# Altium schematic sheet CONNECTOR_A.SchDoc: =project_title
size Tabloid; CompanyName: Luxonis Holding; Organization: Luxonis Holding; Address1: 1925 Harmony Park Drive; Address2: Westminster, CO; Address3: 80234; Address4: United States; SheetNumber: 5; SheetTotal: 15
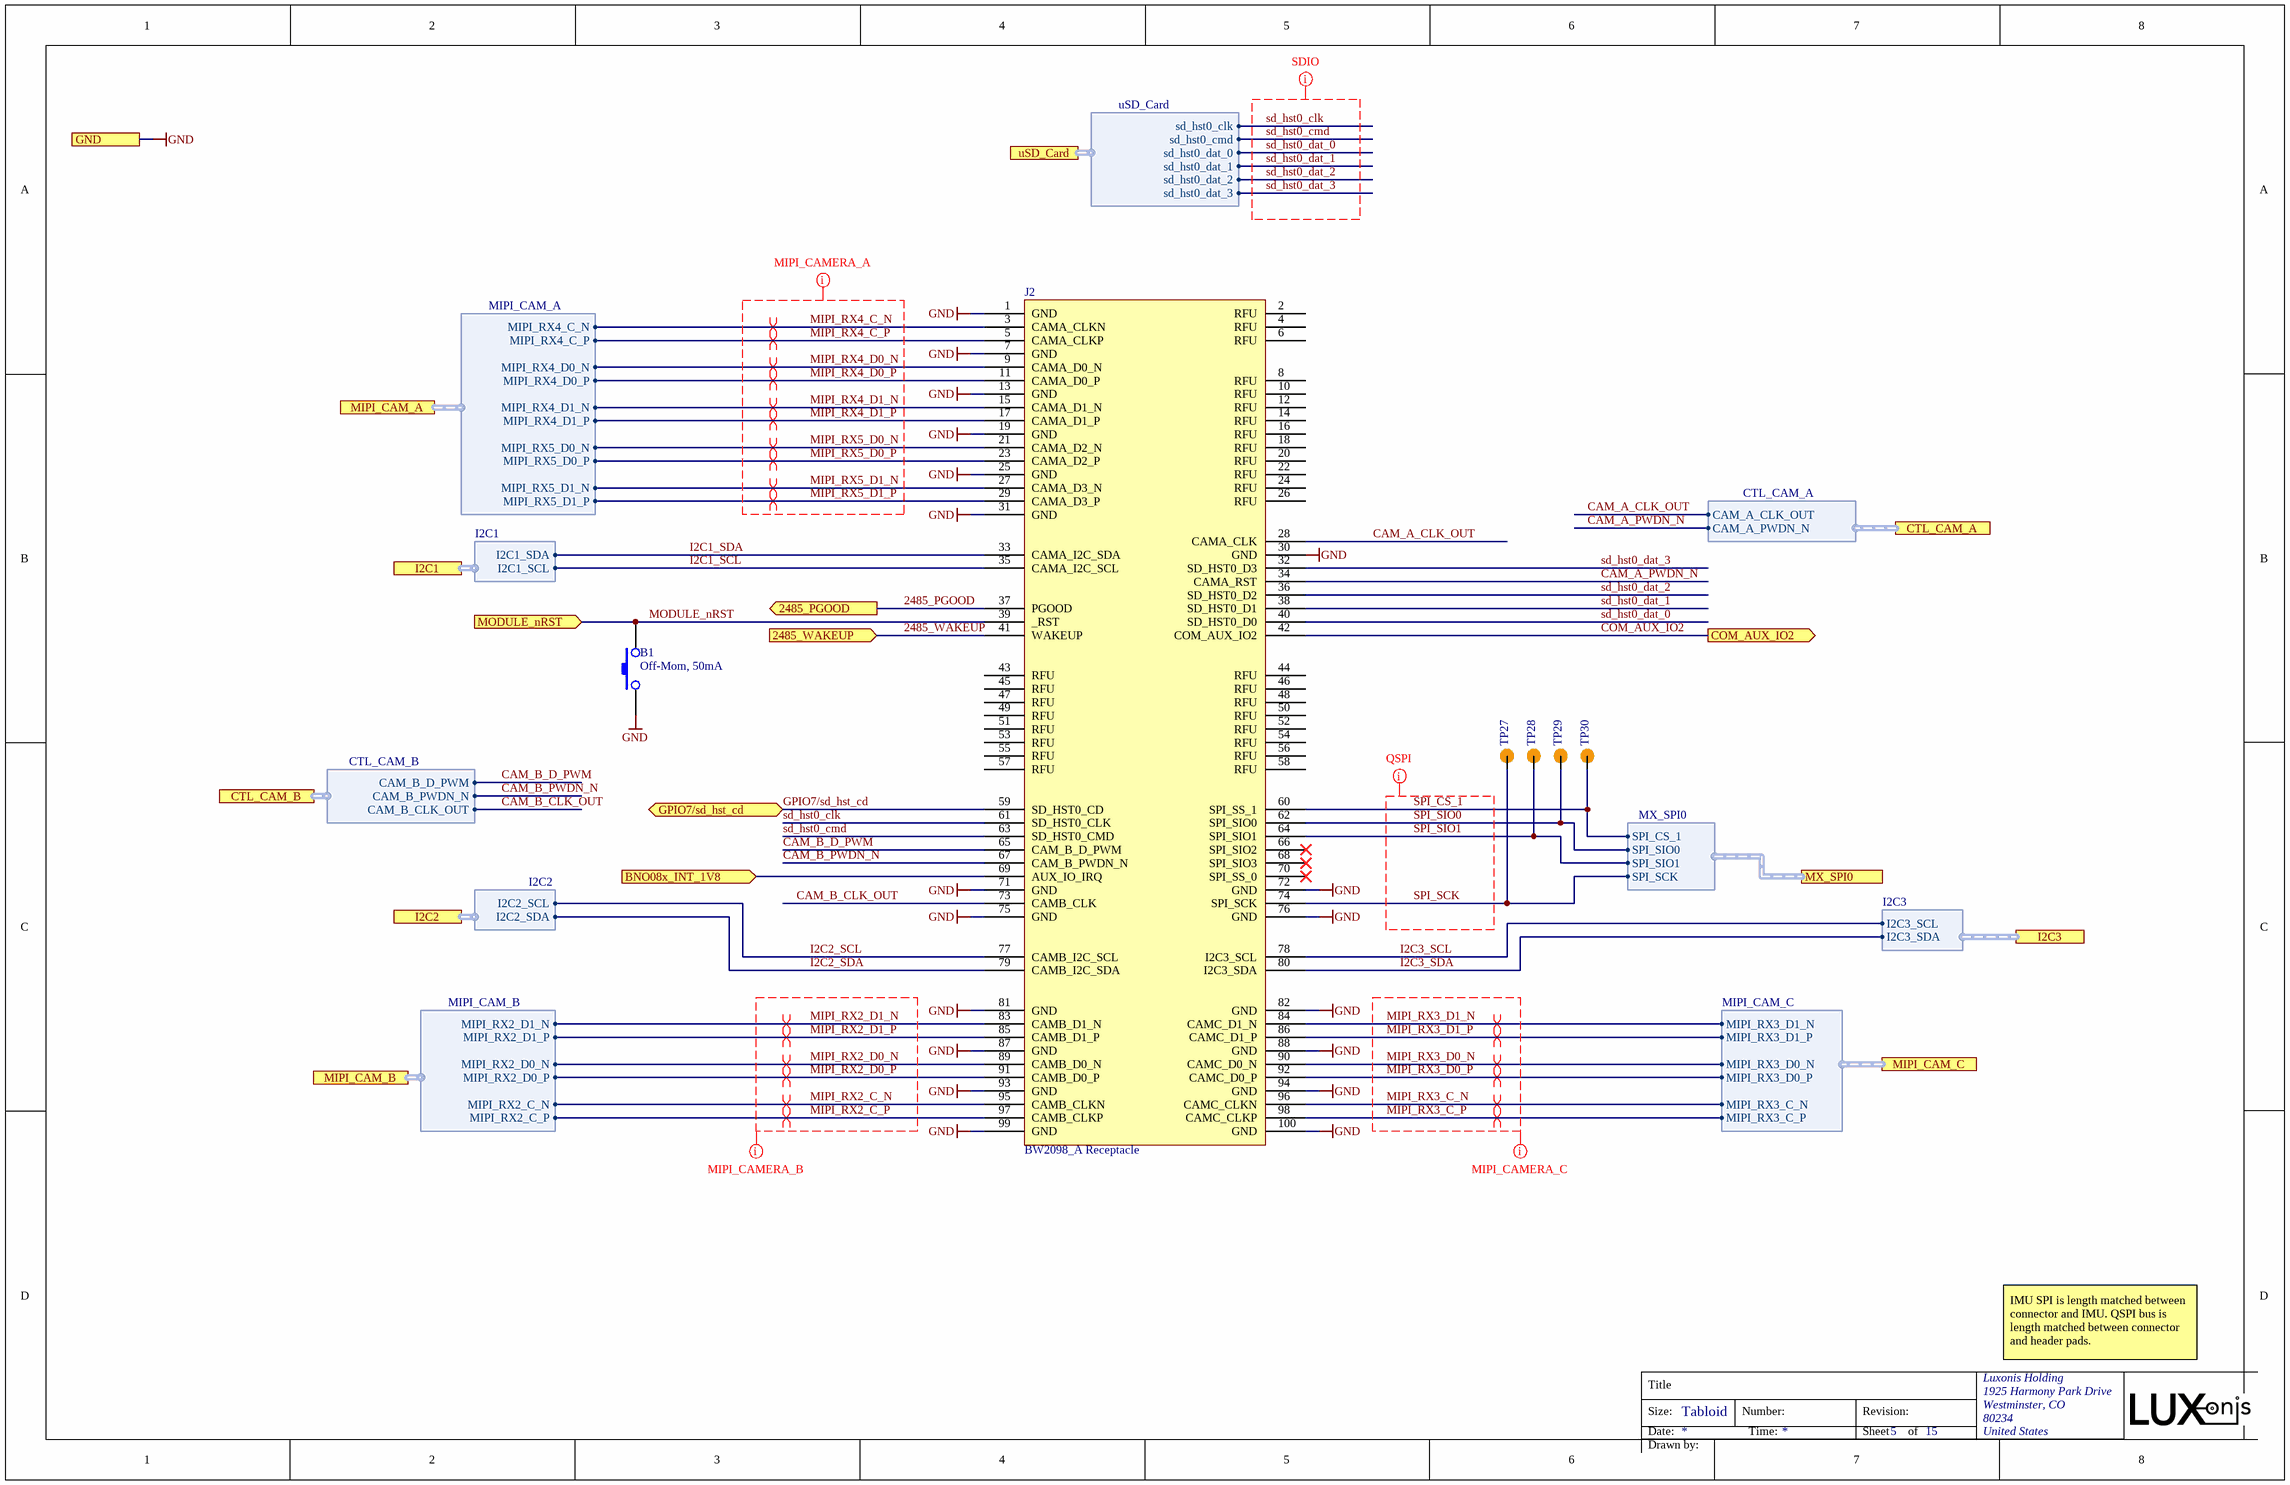
[diagram p0: CONNECTOR_A.SchDoc]

## Parts
B1  Off-Mom, 50mA  [DTSM-32N-V]
J2  BW2098_A Receptacle  [DF40HC-3.0-100DS-0.4V_minpad]
TP27  TP100_200_NS  [TP100_200_NS]  (value not drawn)  (no BOM)
TP28  TP100_200_NS  [TP100_200_NS]  (value not drawn)  (no BOM)
TP29  TP100_200_NS  [TP100_200_NS]  (value not drawn)  (no BOM)
TP30  TP100_200_NS  [TP100_200_NS]  (value not drawn)  (no BOM)

## Ports
2485_PGOOD (out), 2485_WAKEUP (in), BNO08x_INT_1V8 (in), COM_AUX_IO2 (out), CTL_CAM_A (harness CTL_CAM_A), CTL_CAM_B (harness CTL_CAM_B), GND, GPIO7/sd_hst_cd (bidir), I2C1 (harness I2C1), I2C2 (harness I2C2), I2C3 (harness I2C3), MIPI_CAM_A (harness MIPI_CAM_A), MIPI_CAM_B (harness MIPI_CAM_B), MIPI_CAM_C (harness MIPI_CAM_C), MODULE_nRST (in), MX_SPI0 (harness MX_SPI0), uSD_Card (harness uSD_Card)

## Harnesses
MIPI_CAM_B: MIPI_RX2_C_P, MIPI_RX2_C_N, MIPI_RX2_D0_P, MIPI_RX2_D0_N, MIPI_RX2_D1_P, MIPI_RX2_D1_N
MIPI_CAM_A: MIPI_RX4_C_N, MIPI_RX4_C_P, MIPI_RX4_D0_N, MIPI_RX4_D0_P, MIPI_RX4_D1_N, MIPI_RX4_D1_P, MIPI_RX5_D0_N, MIPI_RX5_D0_P, MIPI_RX5_D1_N, MIPI_RX5_D1_P
MIPI_CAM_C: MIPI_RX3_C_P, MIPI_RX3_C_N, MIPI_RX3_D0_P, MIPI_RX3_D0_N, MIPI_RX3_D1_P, MIPI_RX3_D1_N
I2C2: I2C2_SDA, I2C2_SCL
I2C1: I2C1_SDA, I2C1_SCL
CTL_CAM_B: CAM_B_PWDN_N, CAM_B_D_PWM, CAM_B_CLK_OUT
I2C3: I2C3_SDA, I2C3_SCL
CTL_CAM_A: CAM_A_PWDN_N, CAM_A_CLK_OUT
uSD_Card: sd_hst0_clk, sd_hst0_cmd, sd_hst0_dat_0, sd_hst0_dat_1, sd_hst0_dat_2, sd_hst0_dat_3
MX_SPI0: SPI_SIO0, SPI_SIO1, SPI_CS_1, SPI_SCK

## Nets
GND: B1.1 J2.1(GND) J2.7(GND) J2.13(GND) J2.19(GND) J2.25(GND) J2.30(GND) J2.31(GND) J2.71(GND) J2.72(GND) J2.75(GND) J2.76(GND) J2.81(GND) J2.82(GND) J2.87(GND) J2.88(GND) J2.93(GND) J2.94(GND) J2.99(GND) J2.100(GND) ; port GND
2485_PGOOD: J2.37(PGOOD) ; port 2485_PGOOD
2485_WAKEUP: J2.41(WAKEUP) ; port 2485_WAKEUP
BNO08x_INT_1V8: J2.69(AUX_IO_IRQ) ; port BNO08x_INT_1V8
CAM_A_CLK_OUT: J2.28(CAMA_CLK) ; port CTL_CAM_A.CAM_A_CLK_OUT
CAM_A_PWDN_N: J2.34(CAMA_RST) ; port CTL_CAM_A.CAM_A_PWDN_N
CAM_B_CLK_OUT: J2.73(CAMB_CLK) ; port CTL_CAM_B.CAM_B_CLK_OUT
CAM_B_D_PWM: J2.65(CAM_B_D_PWM) ; port CTL_CAM_B.CAM_B_D_PWM
CAM_B_PWDN_N: J2.67(CAM_B_PWDN_N) ; port CTL_CAM_B.CAM_B_PWDN_N
COM_AUX_IO2: J2.42(COM_AUX_IO2) ; port COM_AUX_IO2
GPIO7/sd_hst_cd: J2.59(SD_HST0_CD) ; port GPIO7/sd_hst_cd
I2C1_SCL: J2.35(CAMA_I2C_SCL) ; port I2C1.I2C1_SCL
I2C1_SDA: J2.33(CAMA_I2C_SDA) ; port I2C1.I2C1_SDA
I2C2_SCL: J2.77(CAMB_I2C_SCL) ; port I2C2.I2C2_SCL
I2C2_SDA: J2.79(CAMB_I2C_SDA) ; port I2C2.I2C2_SDA
I2C3_SCL: J2.78(I2C3_SCL) ; port I2C3.I2C3_SCL
I2C3_SDA: J2.80(I2C3_SDA) ; port I2C3.I2C3_SDA
MIPI_RX2_C_N: J2.95(CAMB_CLKN) ; port MIPI_CAM_B.MIPI_RX2_C_N
MIPI_RX2_C_P: J2.97(CAMB_CLKP) ; port MIPI_CAM_B.MIPI_RX2_C_P
MIPI_RX2_D0_N: J2.89(CAMB_D0_N) ; port MIPI_CAM_B.MIPI_RX2_D0_N
MIPI_RX2_D0_P: J2.91(CAMB_D0_P) ; port MIPI_CAM_B.MIPI_RX2_D0_P
MIPI_RX2_D1_N: J2.83(CAMB_D1_N) ; port MIPI_CAM_B.MIPI_RX2_D1_N
MIPI_RX2_D1_P: J2.85(CAMB_D1_P) ; port MIPI_CAM_B.MIPI_RX2_D1_P
MIPI_RX3_C_N: J2.96(CAMC_CLKN) ; port MIPI_CAM_C.MIPI_RX3_C_N
MIPI_RX3_C_P: J2.98(CAMC_CLKP) ; port MIPI_CAM_C.MIPI_RX3_C_P
MIPI_RX3_D0_N: J2.90(CAMC_D0_N) ; port MIPI_CAM_C.MIPI_RX3_D0_N
MIPI_RX3_D0_P: J2.92(CAMC_D0_P) ; port MIPI_CAM_C.MIPI_RX3_D0_P
MIPI_RX3_D1_N: J2.84(CAMC_D1_N) ; port MIPI_CAM_C.MIPI_RX3_D1_N
MIPI_RX3_D1_P: J2.86(CAMC_D1_P) ; port MIPI_CAM_C.MIPI_RX3_D1_P
MIPI_RX4_C_N: J2.3(CAMA_CLKN) ; port MIPI_CAM_A.MIPI_RX4_C_N
MIPI_RX4_C_P: J2.5(CAMA_CLKP) ; port MIPI_CAM_A.MIPI_RX4_C_P
MIPI_RX4_D0_N: J2.9(CAMA_D0_N) ; port MIPI_CAM_A.MIPI_RX4_D0_N
MIPI_RX4_D0_P: J2.11(CAMA_D0_P) ; port MIPI_CAM_A.MIPI_RX4_D0_P
MIPI_RX4_D1_N: J2.15(CAMA_D1_N) ; port MIPI_CAM_A.MIPI_RX4_D1_N
MIPI_RX4_D1_P: J2.17(CAMA_D1_P) ; port MIPI_CAM_A.MIPI_RX4_D1_P
MIPI_RX5_D0_N: J2.21(CAMA_D2_N) ; port MIPI_CAM_A.MIPI_RX5_D0_N
MIPI_RX5_D0_P: J2.23(CAMA_D2_P) ; port MIPI_CAM_A.MIPI_RX5_D0_P
MIPI_RX5_D1_N: J2.27(CAMA_D3_N) ; port MIPI_CAM_A.MIPI_RX5_D1_N
MIPI_RX5_D1_P: J2.29(CAMA_D3_P) ; port MIPI_CAM_A.MIPI_RX5_D1_P
MODULE_nRST: B1.2 J2.39(_RST) ; port MODULE_nRST
sd_hst0_clk: J2.61(SD_HST0_CLK) ; port uSD_Card.sd_hst0_clk
sd_hst0_cmd: J2.63(SD_HST0_CMD) ; port uSD_Card.sd_hst0_cmd
sd_hst0_dat_0: J2.40(SD_HST0_D0) ; port uSD_Card.sd_hst0_dat_0
sd_hst0_dat_1: J2.38(SD_HST0_D1) ; port uSD_Card.sd_hst0_dat_1
sd_hst0_dat_2: J2.36(SD_HST0_D2) ; port uSD_Card.sd_hst0_dat_2
sd_hst0_dat_3: J2.32(SD_HST0_D3) ; port uSD_Card.sd_hst0_dat_3
SPI_CS_1: J2.60(SPI_SS_1) TP30.1 ; port MX_SPI0.SPI_CS_1
SPI_SCK: J2.74(SPI_SCK) TP27.1 ; port MX_SPI0.SPI_SCK
SPI_SIO0: J2.62(SPI_SIO0) TP29.1 ; port MX_SPI0.SPI_SIO0
SPI_SIO1: J2.64(SPI_SIO1) TP28.1 ; port MX_SPI0.SPI_SIO1

Not connected (* = marked no-connect by the designer): J2 2(RFU) 4(RFU) 6(RFU) 8(RFU) 10(RFU) 12(RFU) 14(RFU) 16(RFU) 18(RFU) 20(RFU) 22(RFU) 24(RFU) 26(RFU) 43(RFU) 44(RFU) 45(RFU) 46(RFU) 47(RFU) 48(RFU) 49(RFU) 50(RFU) 51(RFU) 52(RFU) 53(RFU) 54(RFU) 55(RFU) 56(RFU) 57(RFU) 58(RFU) 66(SPI_SIO2)* 68(SPI_SIO3)* 70(SPI_SS_0)*

## Layout directives
differential pair; differential pair class 100ohm: MIPI_RX2_C_N, MIPI_RX2_C_P, MIPI_RX2_D0_N, MIPI_RX2_D0_P, MIPI_RX2_D1_N, MIPI_RX2_D1_P, MIPI_RX3_C_N, MIPI_RX3_C_P, MIPI_RX3_D0_N, MIPI_RX3_D0_P, MIPI_RX3_D1_N, MIPI_RX3_D1_P, MIPI_RX4_C_N, MIPI_RX4_C_P, MIPI_RX4_D0_N, MIPI_RX4_D0_P, MIPI_RX4_D1_N, MIPI_RX4_D1_P, MIPI_RX5_D0_N, MIPI_RX5_D0_P, MIPI_RX5_D1_N, MIPI_RX5_D1_P
net class MIPI_CAM_A: MIPI_RX4_C_N, MIPI_RX4_C_P, MIPI_RX4_D0_N, MIPI_RX4_D0_P, MIPI_RX4_D1_N, MIPI_RX4_D1_P, MIPI_RX5_D0_N, MIPI_RX5_D0_P, MIPI_RX5_D1_N, MIPI_RX5_D1_P
net class MIPI_CAM_C: MIPI_RX3_C_N, MIPI_RX3_C_P, MIPI_RX3_D0_N, MIPI_RX3_D0_P, MIPI_RX3_D1_N, MIPI_RX3_D1_P
net class MIPI_CAM_B: MIPI_RX2_C_N, MIPI_RX2_C_P, MIPI_RX2_D0_N, MIPI_RX2_D0_P, MIPI_RX2_D1_N, MIPI_RX2_D1_P
net class QSPI: SPI_CS_1, SPI_SCK, SPI_SIO0, SPI_SIO1
net class SDIO: sd_hst0_clk, sd_hst0_cmd, sd_hst0_dat_0, sd_hst0_dat_1, sd_hst0_dat_2, sd_hst0_dat_3

## Notes on the sheet
- IMU SPI is length matched between connector and IMU. QSPI bus is length matched between connector and header pads.
- Title
- Size:
- Date:
- Tabloid
- Number:
- Time:
- Revision:
- Sheet
- of
- Drawn by:

## Library data of the parts
B1 = DTSM-32N-V: SWITCH TACTILE SMT 3.5mm * 6mm , brown 160gf; Manufacturer 1: Diptronics; Manufacturer Part Number 1: DTSM-32N-V-T/R; Supplier 1: Mouser; Stock 1: 3199; Pricing 1: 1=0.38000, 10=0.38000, 50=0.31000, 100=0.28200, 500=0.25600, 1000=0.23600, 1600=0.20900, 4800=0.18800, 9600=0.17300, 10000=0.17300, 24000=0.16100 (USD); RoHS: No; Min Operating Temperature: -30°C; Max Operating Temperature: 80°C; Length: 6mm; Height: 5mm; Width: 3.5mm; ComponentLink1URL: https://datasheet.ciiva.com/29188/708548-da-01-en-tastschalter-smd-dtsm-32n-v-tr-1600st-29188823.pdf?src-supplier=Conrad; ComponentLink1Description: https://datasheet.ciiva.com/29188/708548-da-01-en-tastschalter-smd-dtsm-32n-v-tr-1600st-29188823.pdf?src-supplier=Conrad; Supplier Part Number 1: 113-DTSM32NVTR
J2 = DF40HC(3.0)-100DS-0.4V_BW2098_A: CONN RCPT 100POS 0.4MM SMD GOLD BW2098_A Receptacle; Manufacturer 1: Hirose; Manufacturer Part Number 1: DF40HC(3.0)-100DS-0.4V(58; Number of Positions: 100; Pitch: 0.016inch; System: Connector; RoHS: Yes; Mount: Surface Mount; Contact Plating: Gold; Packaging: Tape and Reel; Number of Rows: 2; Package Quantity: 1000; Connector Type: Receptacle; Lead Free: Lead Free; ComponentLink1URL: https://datasheet.ciiva.com/46636/ed-df40-20140305-46636517.pdf?src-supplier=Digi-Key; ComponentLink1Description: https://datasheet.ciiva.com/46636/ed-df40-20140305-46636517.pdf?src-supplier=Digi-Key; ComponentLink2URL: https://datasheet.ciiva.com/18562/ed-df40-20140305-18562189.pdf?src-supplier=Digi-Key; ComponentLink2Description: https://datasheet.ciiva.com/18562/ed-df40-20140305-18562189.pdf?src-supplier=Digi-Key; ComponentLink3URL: https://datasheet.ciiva.com/13559/ed-df40-20140305-13559540.pdf?src-supplier=Mouser; ComponentLink3Description: https://datasheet.ciiva.com/13559/ed-df40-20140305-13559540.pdf?src-supplier=Mouser; ComponentLink4URL: https://datasheet.ciiva.com/18562/ed-df40-20140305-18562462.pdf?src-supplier=Digi-Key; ComponentLink4Description: https://datasheet.ciiva.com/18562/ed-df40-20140305-18562462.pdf?src-supplier=Digi-Key; Supplier 1: Mouser; Stock 1: 2172; Pricing 1: 1=2.54000, 10=2.26000, 25=2.07000, 50=2.07000, 100=1.98000, 250=1.79000, 500=1.65000, 1000=1.41000, 3000=1.32000, 6000=1.23000, 10000=1.23000 (USD); Supplier 2: Mouser; Manufacturer 2: Hirose; Manufacturer Part Number 2: DF40HC(3.0)-100DS-0.4V(58); Stock 2: 2078; Pricing 2: 1=2.50000, 10=2.40000, 25=2.10000, 50=2.10000, 100=2.00000, 250=1.76000, 500=1.71000, 1000=1.45000, 2000=1.36000, 5000=1.31000, 10000=1.31000 (USD); Supplier Part Number 1: 798-DF40HC30100DS451; Supplier Part Number 2: 798-DF40HC30100DS458
TP27-TP30 = TEST_POINT